# Altium schematic sheet MCU.SchDoc
size A4; SheetNumber: 4; SheetTotal: 5
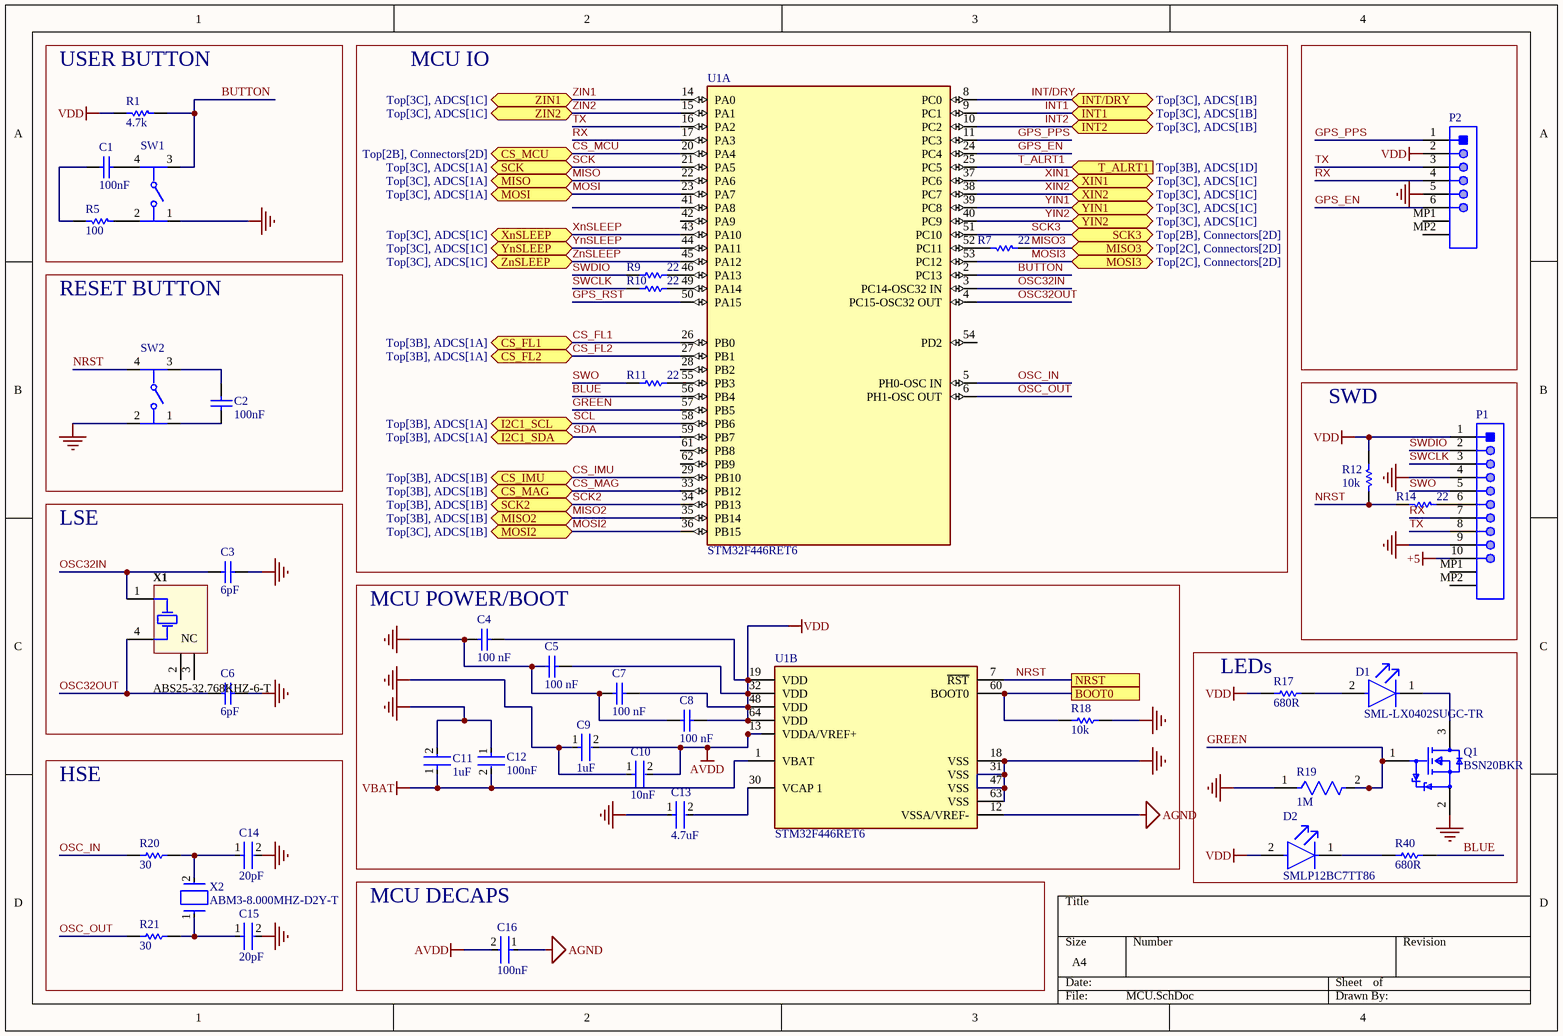
[diagram p0: MCU.SchDoc]

## Parts
C1  100nF  [CAPC1050X55X23ML05T13]
C2  100nF  [CAPC1050X55X23ML05T13]
C3  6pF  [CAPC1005X55X25ML05T10]
C4  100 nF  [CAPC1050X55X23ML05T13]
C5  100 nF  [CAPC1050X55X23ML05T13]
C6  6pF  [CAPC1005X55X25ML05T10]
C7  100 nF  [CAPC1050X55X23ML05T13]
C8  100 nF  [CAPC1050X55X23ML05T13]
C9  1uF  [FP-CL10-IPC_A]
C10  10nF  [FP-CL165-IPC_C]
C11  1uF  [FP-CL10-IPC_C]
C12  100nF  [FP-CC0402-MFG]
C13  4.7uF  [FP-CC0805-0_85-MFG]
C14  20pF  [FP-CC0603-0_9-MFG]
C15  20pF  [FP-CC0603-0_9-MFG]
C16  100nF  [FP-CC0402-MFG]
D1  SML-LX0402SUGC-TR  [FP-SML-LX0402SUGC-TR-MFG]
D2  SMLP12BC7TT86  [FP-SML-P12-MFG]
P1  SM10B-SHLS-TF(LF)(SN)  [JST-SM10B-SHLS-TF_V]  (value not drawn)
P2  SM06B-SRSS-TB(LF)(SN)  [JST-SM06B-SRSS-TB_V]  (value not drawn)
Q1  BSN20BKR  [FP-SOT23-IPC_C]
R1  4.7k  [RESC1005X40X25LL05T05]
R5  100  [RESC1608X55X30LL15T15]
R7  22  [RESC1608X55X25NL10T15]
R9  22  [RESC1005X40X25ML05T05]
R10  22  [RESC1005X40X25ML05T05]
R11  22  [RESC1005X40X25ML05T05]
R12  10k  [RESC1005X40X25LL05T10]
R14  22  [RESC1608X55X25NL10T15]
R17  680R  [RESC1005X40X25ML05T05]
R18  10k  [RESC1005X40X25LL05T05]
R19  1M  [FP-MCR01-IPC_B]
R20  30  [RESC1609X50X30NL10T20]
R21  30  [RESC1609X50X30NL10T20]
R40  680R  [RESC1005X40X25ML05T05]
SW1  PTS810SJM250SMTRLFS  [FP-PTS810SJM250SMTRLFS-MFG]  (value not drawn)
SW2  PTS810SJM250SMTRLFS  [FP-PTS810SJM250SMTRLFS-MFG]  (value not drawn)
U1  STM32F446RET6  [FP-LQFP64-5W-MFG]  (parts A,B of 2)
X1  ABS25-32.768KHZ-6-T  [ABRA-ABS25-4_V]
X2  ABM3-8.000MHZ-D2Y-T  [FP-ABM3-MFG]

## Blocks framed on the sheet
USER BUTTON: C1 R1 R5 SW1
MCU IO: R7 R9-R11 U1
RESET BUTTON: C2 SW2
SWD: P1 R12 R14
LSE: C3 C6 X1
MCU POWER/BOOT: C4 C5 C7-C13 R18 U1
LEDs: D1 D2 Q1 R17 R19 R40
HSE: C14 C15 R20 R21 X2
MCU DECAPS: C16

## Ports
BOOT0 (see Top[2B], Connectors[2D]), CS_FL1 (bidir, see Top[3B], ADCS[1A]), CS_FL2 (bidir, see Top[3B], ADCS[1A]), CS_IMU (bidir, see Top[3B], ADCS[1B]), CS_MAG (bidir, see Top[3B], ADCS[1B]), CS_MCU (bidir, see Top[2B], Connectors[2D]), I2C1_SCL (bidir, see Top[3B], ADCS[1A]), I2C1_SDA (bidir, see Top[3B], ADCS[1A]), INT1 (bidir, see Top[3C], ADCS[1B]), INT2 (bidir, see Top[3C], ADCS[1B]), INT/DRY (bidir, see Top[3C], ADCS[1B]), MISO2 (bidir, see Top[3B], ADCS[1B]), MISO3 (bidir, see Top[2C], Connectors[2D]), MISO (bidir, see Top[3C], ADCS[1A]), MOSI2 (bidir, see Top[3C], ADCS[1B]), MOSI3 (bidir, see Top[2C], Connectors[2D]), MOSI (bidir, see Top[3C], ADCS[1A]), NRST (see Top[2B], Connectors[2D]), SCK2 (bidir, see Top[3B], ADCS[1B]), SCK3 (bidir, see Top[2B], Connectors[2D]), SCK (bidir, see Top[3C], ADCS[1A]), T_ALRT1 (in, see Top[3B], ADCS[1D]), XIN1 (bidir, see Top[3C], ADCS[1C]), XIN2 (bidir, see Top[3C], ADCS[1C]), XnSLEEP (bidir, see Top[3C], ADCS[1C]), YIN1 (bidir, see Top[3C], ADCS[1C]), YIN2 (bidir, see Top[3C], ADCS[1C]), YnSLEEP (bidir, see Top[3C], ADCS[1C]), ZIN1 (bidir, see Top[3C], ADCS[1C]), ZIN2 (bidir, see Top[3C], ADCS[1C]), ZnSLEEP (bidir, see Top[3C], ADCS[1C])

## Nets
+5: P1.10
AGND: C16.1 U1.12(VSSA/VREF-)
AVDD: C9.2 C10.2 C16.2 U1.13(VDDA/VREF+)
GND: C3.2 C4.1 C5.1 C6.2 C7.1 C8.1 C9.1 C10.1 C11.2 C12.1 C13.1 C14.2 C15.2 P1.4 P1.9 P2.5 Q1.2(S) R18.1 R19.1 SW1.1 SW2.2 U1.18(VSS) U1.31(VSS) U1.47(VSS) U1.63(VSS)
VBAT: C11.1 C12.2 U1.1(VBAT)
VDD: C4.2 C5.2 C7.2 C8.2 D2.2(A) P1.1 P2.2 R1.2 R12.1 R17.1 U1.19(VDD) U1.32(VDD) U1.48(VDD) U1.64(VDD)
BLUE: R40.2 U1.56(PB4)
BOOT0: R18.2 U1.60(BOOT0) ; port BOOT0
BUTTON: R1.1 SW1.3 U1.2(PC13)
CS_FL1: U1.26(PB0) ; port CS_FL1
CS_FL2: U1.27(PB1) ; port CS_FL2
CS_IMU: U1.29(PB10) ; port CS_IMU
CS_MAG: U1.33(PB12) ; port CS_MAG
CS_MCU: U1.20(PA4) ; port CS_MCU
GPS_EN: P2.6 U1.24(PC4)
GPS_PPS: P2.1 U1.11(PC3)
GPS_RST: U1.50(PA15)
GREEN: Q1.1(G) R19.2 U1.57(PB5)
INT1: U1.9(PC1) ; port INT1
INT2: U1.10(PC2) ; port INT2
INT/DRY: U1.8(PC0) ; port INT/DRY
MISO: U1.22(PA6) ; port MISO
MISO2: U1.35(PB14) ; port MISO2
MISO3: R7.1 ; port MISO3
MOSI: U1.23(PA7) ; port MOSI
MOSI2: U1.36(PB15) ; port MOSI2
MOSI3: U1.53(PC12) ; port MOSI3
NRST: R12.2 R14.2 SW2.4 U1.7(~{RST}) ; port NRST
OSC32IN: C3.1 U1.3(PC14-OSC32_IN) X1.1(X1)
OSC32OUT: C6.1 U1.4(PC15-OSC32_OUT) X1.4(X2)
OSC_IN: R20.1 U1.5(PH0-OSC_IN)
OSC_OUT: R21.1 U1.6(PH1-OSC_OUT)
RX: P1.7 P2.4 U1.17(PA3)
SCK: U1.21(PA5) ; port SCK
SCK2: U1.34(PB13) ; port SCK2
SCK3: U1.51(PC10) ; port SCK3
SCL: U1.58(PB6) ; port I2C1_SCL
SDA: U1.59(PB7) ; port I2C1_SDA
SWCLK: P1.3 R10.1
SWDIO: P1.2 R9.1
SWO: P1.5 R11.1
T_ALRT1: U1.25(PC5) ; port T_ALRT1
TX: P1.8 P2.3 U1.16(PA2)
XIN1: U1.37(PC6) ; port XIN1
XIN2: U1.38(PC7) ; port XIN2
XnSLEEP: U1.43(PA10) ; port XnSLEEP
YIN1: U1.39(PC8) ; port YIN1
YIN2: U1.40(PC9) ; port YIN2
YnSLEEP: U1.44(PA11) ; port YnSLEEP
ZIN1: U1.14(PA0) ; port ZIN1
ZIN2: U1.15(PA1) ; port ZIN2
ZnSLEEP: U1.45(PA12) ; port ZnSLEEP
NetC1_1: C1.1 SW1.4
NetC1_2: C1.2 R5.2
NetC2_1: C2.1 SW2.1
NetC2_2: C2.2 SW2.3
NetC13_2: C13.2 U1.30(VCAP_1)
NetC14_1: C14.1 R20.2 X2.2
NetC15_1: C15.1 R21.2 X2.1
NetD1_1: D1.1(C) Q1.3(D)
NetD1_2: D1.2(A) R17.2
NetD2_1: D2.1(C) R40.1
NetP1_6: P1.6 R14.1
NetR5_1: R5.1 SW1.2
NetR7_2: R7.2 U1.52(PC11)
NetR9_2: R9.2 U1.46(PA13)
NetR10_2: R10.2 U1.49(PA14)
NetR11_2: R11.2 U1.55(PB3)

Not connected (* = marked no-connect by the designer): P1 MP1 MP2; P2 MP1 MP2; U1 28(PB2) 41(PA8) 42(PA9) 54(PD2) 61(PB8) 62(PB9); X1 2(NC) 3(NC)

## Library data of the parts
C1 C2 C4 C5 C7 C8 = CMP-2000-05439-1: Chip Capacitor, 100 nF, +/- 10%, 16 V, -55 to 125 degC, 0402 (1005 Metric), RoHS, Tape and Reel; Manufacturer: Samsung Electro-Mechanics; Capacitance: 100000pF; Dielectric: X7R; Rated Voltage: 16V; Case Size/Dimension: 0402; Tolerance (%): ±10%; Manufacturer URL: http://www.samsungsem.com/global/index.jsp; Datasheet URL: https://datasheet.ciiva.com/29198/458718-da-01-en-vs-kondensator-0402-29198423.pdf; Datasheet Version: Nov-10
C3 C6 = CMP-2008-04413-1: Part Number: GRM1555C1H6R0DA01D; Manufacturer: Murata
C9 = CMP-13271-001457-1: Cap Ceramic 1uF 16V X5R ±10% Pad SMD 0603 +85°C T/R; Dielectric: X5R; Height: 0.8mm; Capacitance: 1uF; Mount: Surface Mount; Thickness: 0.035inch; Width: 0.031inch; Min Operating Temperature: -55°C; Contact Plating: Tin; Case Code (Imperial): 0603; Depth: 0.8mm; Length: 1.6mm; Max Operating Temperature: 85°C; Packaging: Tape and Reel; Tolerance: 10%; Radiation Hardening: No; Case/Package: 0603; Package Quantity: 1; Voltage Rating: 16V; Case Code (Metric): 1608; Voltage: 16V; Material: Ceramic; Lead Free: Lead Free; Voltage Rating (DC): 16V
C10 = CMP-13271-000387-1: Cap Ceramic 10nF 50V X7R ±10% SMD 0402 +125°C Paper T/R; Depth: 0.5mm; Length: 1mm; Lead Free: Lead Free; Case Code (Metric): 1005; Width: 0.02inch; Min Operating Temperature: -55°C; Thickness: 0.022inch; Package Quantity: 1; Mount: Surface Mount; Height: 0.5mm; Voltage: 50V; Material: Ceramic; Tolerance: 10%; Case Code (Imperial): 0402; Radiation Hardening: No; Case/Package: 0402; Max Operating Temperature: 125°C; Voltage Rating (DC): 50V; Contact Plating: Tin; Packaging: Tape and Reel; Voltage Rating: 50V; Capacitance: 10nF; Dielectric: X7R
C11 = CMP-13271-004127-1: Cap Ceramic 1uF 25V X5R ±10% Pad SMD 0603 +85°C T/R; Height: 0.8mm; Capacitance: 1uF; Depth: 0.8mm; Package Quantity: 1; Mount: Surface Mount; Contact Plating: Tin; Voltage Rating: 25V; Dielectric: X5R; Packaging: Tape and Reel; Material: Ceramic; Case Code (Metric): 1608; Length: 1.6mm; Voltage: 25V; Min Operating Temperature: -55°C; Width: 0.031inch; Tolerance: 10%; Case/Package: 0603; Radiation Hardening: No; Case Code (Imperial): 0603; Thickness: 0.035inch; Lead Free: Lead Free; Max Operating Temperature: 85°C; Voltage Rating (DC): 25V
C12 C16 = CMP-03422-000048-1: CAP CER 0.1UF 16V X7R 0402; Manufacturer: YAGEO; Manufacturer Part Number: CC0402KRX7R7BB104; Material: Ceramic; Automotive Grade: NA; Temperature Coefficient: 30ppm/°C; Tolerance: 0.1; Device Class L1: Passive Components; Temperature Range Low: -55°C; Device Class L3: Ceramic Capacitors; Temperature Characteristic: X7R; Ipc Land Pattern Name: CAPC10050X50; Capacitance: 100 nF; Temperature Range High: +125°C; Voltage Rating: 16 V; Temperature: -55°C to +125°C; RoHS: TRUE; Automotive: No; Height: 0.55mm; Device Class L2: Capacitors; Digikey Description: CAP CER 0.1UF 16V X7R 0402; Package: CC0402; Footprint Url: http://www.yageo.com/exep/pages/download/literatures/UPY-C_GEN_24.pdf; ComponentLink2Description: Datasheet; Category: Cap; Lead Free: Yes; Value: 100 nF; Octopart: https://octopart.com/cc0402krx7r7bb104-yageo-42244624; ComponentLink2URL: http://www.yageo.com/documents/recent/UPY-GP_NP0_16V-to-50V_16.pdf; Mouser Description: 0402 0.1 uF 16 V ±10 % Tolerance X7R SMT Multilayer Ceramic Capacitor
C13 = CMP-03422-000207-1: CAP CER 4.7UF 16V X7R 0805; Manufacturer: Yageo; Manufacturer Part Number: CC0805KKX7R7BB475; Tolerance: 0.1; Material: Ceramic; Footprint Url: http://www.yageo.com/exep/pages/download/literatures/UPY-C_GEN_24.pdf; Device Class L3: Ceramic Capacitors; Temperature: -30°C to +85°C; Device Class L2: Capacitors; Automotive: No; Digikey Description: CAP CER 4.7UF 16V X7R 0805; Temperature Range High: +85°C; Lead Free: Yes; Mouser Description: Multilayer Ceramic Capacitors MLCC - SMD/SMT 4.7M pF 10% 16 Volts; Temperature Characteristic: X7R; Height: 0.95mm; Device Class L1: Passive Components; ComponentLink2Description: Datasheet; Category: Cap; Octopart: https://octopart.com/cc0805kkx7r7bb475-yageo-34429188; Temperature Range Low: -30°C; Package: CC0805-0.85; Ipc Land Pattern Name: CAPC200125X85; RoHS: TRUE; Value: 4.7 uF; Capacitance: 4.7 uF; ComponentLink2URL: http://www.yageo.com/documents/recent/UPY-GPHC_Y5V_6.3V-to-50V_8.pdf; Voltage Rating: 16 V
C14 C15 = CMP-03422-001514-1: CAP CER 20PF 50V C0G/NPO 0603; Dielectric: NP0; Tolerance: 5%; Package Quantity: 1; Number of Pins: 2; RoHS Compliant: Yes; Voltage Rating (DC): 50V; Depth: 0.8mm; Resistor Type: Ceramic; Case Code (Imperial): 0603; Max Operating Temperature: 125°C; Width: 0.031inch; Min Operating Temperature: -55°C; Case Code (Metric): 1608; Length: 0.063inch; Voltage Rating: 50V; Lead Free: Lead Free; Packaging: Tape and Reel; Series: CC; Mount: Surface Mount; Termination: SMD/SMT; Case/Package: 0603; Thickness: 0.035inch; Weight: 7.1E-05oz; Capacitance: 20pF
D1 = CMP-57192-000001-1: LED GREEN CLEAR SMD; Forward Voltage: 2.2V; Test Current: 20mA; Luminous Intensity: 45mcd; Lens Style: Diffused; Number of LEDs: 1; Approvals: UL; Lens Color: Colorless; Dominant Wavelength: 574nm; Viewing Angle: 120°; Lead Free: Lead Free; Case/Package: 0402; Number of Pins: 2; Width: 0.5mm; Min Operating Temperature: -40°C; Case Code (Imperial): 0402; Packaging: Tape and Reel; Color: Green; Max Operating Temperature: 85°C; Case Code (Metric): 1005; Mount: Surface Mount; Length: 1mm; Wavelength: 574nm; Height: 0.5mm; Illumination Color: Green; Lens Transparency: Clear; Package Quantity: 1; Forward Current: 20mA
D2 = CMP-08952-000025-1: LED BLUE CLEAR 1006 SMD; Manufacturer: Rohm; Led Orientation: Top View; Reverse Voltage: 5V; Wavelength: 470nm; Luminous Intensity: 17mcd; Power Dissipation: 66mW; Forward Voltage: 2.9V; Forward Current: 5mA; ComponentLink2URL: https://media.digikey.com/pdf/Data%20Sheets/Rohm%20PDFs/SML-P1_Series_RevB.pdf; ComponentLink2Description: Datasheet; Colour: Blue; RoHS: TRUE; Package: SML-P12; Device Class L1: Optoelectronics; Manufacturer Part Number: SMLP12BC7TT86; Automotive: No; Temperature Range Low: -40°C; Temperature: -40°C to +85°C; Height: 0.25mm; Octopart: https://octopart.com/smlp12bc7tt86-rohm-9290887; Digikey Description: LED BLUE CLEAR 1006 SMD; Lead Free: Yes; Device Class L2: LEDs; Category: Diode; Device Class L3: unset; Mouser Description: ROHM SMLP12BC7TT86, SML-P12 PICOLED Series Blue LED, 1006(0402), Rectangle Lens; Temperature Range High: +85°C
P1 = CMP-2000-07083-1: Male Header, Pitch 1 mm, 1 x 10 Position, Height 1.8 mm, -25 to 85 degC; Manufacturer: JST; Datasheet URL: http://www.jst-mfg.com/product/pdf/eng/eSHL.pdf; Mounting Technology: SurfaceMount; Package Reference: SM10B-SHLS-TF; Manufacturer URL: http://www.jst.com/home2.html; Package Description: Male Header, Pitch 1 mm, 1 x 10 Position, Height 1.8 mm; Datasheet Version: 04/2015
P2 = CMP-2000-07080-1: Male Header, Pitch 1 mm, 1 x 6 Position, Height 2.95 mm, -25 to 85 degC, RoHS, Tape and Reel; Manufacturer: JST; No of Positions: 6; Pitch: 1mm; Style/Orientation: RightAngleHeader/Plug; Datasheet URL: https://datasheet.ciiva.com/26894/getdatasheetpartid-708885-26894671.pdf; Package Description: Male Header, Pitch 1 mm, 1 X 6 Position, Height 2.9 mm; Termination: Solder; Manufacturer URL: http://www.jst.com/home2.html; Type: ShroudedHeader; Package Reference: SM06B-SRSS-TB; Datasheet Version: 11/2010; Mounting Technology: SurfaceMount
Q1 = CMP-14409-000038-1: MOSFET N-CH 60V 265MA TO236AB
R1 = CMP-2002-01154-4: Chip Resistor, 4.7 KOhm, +/- 1%, 0.1 W, -55 to 155 degC, 0402 (1005 Metric), RoHS, Tape and Reel; PartNumber: ERJ-2RKF4701X; Voltage Rating: 50 V; Case\/Package: 0402; Power Rating: 100 mW; Height: 0.35 mm; Mounting Technology: Surface Mount; REACH SVHC: Yes; Resistance: 4.7 KOhm; Max Operating Temperature: 155 degC; ComponentLink1Description: Manufacturer URL; ComponentLink2Description: Datasheet; Pins: 2; PackageReference: 0402; Tolerance: 1%; Case Code (Imperial): 0402; Length: 1 mm; PackageDescription: 2-Pin Surface Mount Device, Body 1 x 0.5 mm; RoHSCompliant: true; Package Quantity: 1; Radiation Hardening: No; DatasheetVersion: 04/2015; Width: 0.5 mm; Case Code (Metric): 1005; Mount: Surface Mount; ComponentLink1URL: http://www.panasonic.com/; Min Operating Temperature: -55 degC; Packaging: Cut Tape; ComponentLink2URL: http://industrial.panasonic.com/cdbs/www-data/pdf/RDA0000/AOA0000C86.pdf
R5 = CMP-2000-00179-1: Manufacturer: Panasonic; Part Number: ERJ-3EKF1000V
R7 R14 = CMP-1659-00033-1: Chip Resistor, 22 Ohm, +/- 1%, 0.1 W, -55 to 155 degC, 0603 (1608 Metric), RoHS, Tape and Reel; Max Ouput Current: 8 A; Case\Package: SIP; Max Input Voltage: 1.4 V; ComponentLink2URL: http://www.yageo.com/documents/recent/PYu-RC_Group_51_RoHS_L_04.pdf; RoHSCompliant: true; Max Operating Temperature: 100 degC; PackageDescription: 2-Pin Surface Mount Device, Body 1.6 x 0.8 mm; ComponentLink1Description: Manufacturer URL; ComponentLink1URL: http://www.yageo.com/; Length: 18.5 mm; REACH SVHC: Unknown; Pins: 4; DatasheetVersion: Rev. 4, 02/2016; PackageReference: 0603; Output Current: 8 A; Min Operating Temperature: -25 degC; Height: 19.6 mm; Mount: Through Hole; Radiation Hardening: No; ComponentLink2Description: Datasheet; Package Quantity: 200; Packaging: Rail/Tube
R9-R11 = CMP-2002-01135-4: Chip Resistor, 22 Ohm, +/- 1%, 0.1 W, -55 to 155 degC, 0402 (1005 Metric), RoHS, Tape and Reel; PartNumber: ERJ-2RKF22R0X; Case\/Package: 0402; Resistance: 22 Ohm; Power Rating: 100 mW; Voltage Rating: 50 V; ComponentLink2Description: Datasheet; Packaging: Tape and Reel; Weight: 2.8E-05oz; Pins: 2; Case Code (Imperial): 0402; Width: 0.5 mm; ComponentLink2URL: http://industrial.panasonic.com/cdbs/www-data/pdf/RDA0000/AOA0000C86.pdf; Height: 0.35 mm; PackageReference: 0402; REACH SVHC: Yes; Min Operating Temperature: -55 degC; Length: 1 mm; DatasheetVersion: 04/2015; RoHSCompliant: true; Package Quantity: 10000; Case Code (Metric): 1005; PackageDescription: 2-Pin Surface Mount Device, Body 1 x 0.5 mm; ComponentLink1URL: http://www.panasonic.com/; Mount: Surface Mount; Mounting Technology: Surface Mount; Tolerance: 1%; Max Operating Temperature: 155 degC; ComponentLink1Description: Manufacturer URL
R12 = CMP-2002-07353-1: Part Number: RC0402FR-0710KL; Manufacturer: Yageo / Phycomp
R17 R40 = CMP-2002-00166-1: Manufacturer: Vishay Dale; Part Number: CRCW0402680RFKED
R18 = CMP-2000-07588-1: Chip Resistor, 10 KOhm, +/- 1%, 0.1 W, -55 to 155 degC, 0402 (1005 Metric), RoHS, Tape and Reel; Manufacturer: Panasonic; Power Rating: 100mW; Voltage Rating: 50V; Resistance: 10KOhm; Case\/Package: 0402; Temperature Coefficient: 100ppm\/degreesC; RoHSCompliant: True; Lead Free: LeadFree; Package Quantity: 1; Contact Plating: Tin; Length: 1mm; Radiation Hardening: No; REACH SVHC: NoSVHC; Max Operating Temperature: 155degC; Depth: 0.5mm; Case Code (Imperial): 0402; Military Standard: Not; Package Description: 2-Pin Surface Mount Device, Body 1 x 0.5 mm; Termination: SMD/SMT; Case Code (Metric): 1005; Height: 0.35mm; Packaging: TapeandReel; Voltage Rating (DC): 50V; Package Reference: 402; Number of Pins: 2; Tolerance: 1%; Mounting Technology: SurfaceMount; Width: 0.02inch; Mount: SurfaceMount; Datasheet URL: https://industrial.panasonic.com/cdbs/www-data/pdf/RDA0000/AOA0000C304.pdf; Composition: ThickFilm; Datasheet Version: 02/2017; Manufacturer URL: http://www.panasonic.com/; Max Power Dissipation: 100mW; Number of Terminations: 2; Min Operating Temperature: -55degC
R19 = CMP-08839-019445-1: Thick Film Chip Resistor, 0402, 1MΩ, 1%, 100ppm/°C, 0.063W, 50V; Max Power Dissipation: 63mW; Resistance: 1MR; Lead Free: Lead Free; Case Code (Imperial): 0402; Max Operating Temperature: 155°C; Package Quantity: 1; Length: 0.039inch; Temperature Coefficient: 100ppm/°C; Case Code (Metric): 1005; Tolerance: 1%; Case/Package: 0402; RoHS Compliant: Yes; Number of Terminations: 2; Resistor Type: Thick Film; Height: 0.016inch; Packaging: Tape and Reel; Min Operating Temperature: -55°C; Voltage Rating (DC): 50V; Width: 0.02inch; Series: MCR
R20 R21 = CMP-2000-03228-1: Part Number: CRCW060330R0FKEA; Manufacturer: Vishay Dale
SW1 SW2 = CMP-10040-000001-2: SWITCH TACTILE SPST-NO 0.05A 16V; Throw Configuration: SPST; Operating Force: 160gf; Actuator Type: Standard; Switch Travel: 0.15mm; Switch Function: Off-Mom; Max Current Rating: 50mA; Mechanical Life: 150000Cycles; Illumination Type: Non-Illuminated; Package Quantity: 2900; Depth: 4.6mm; Mount: Surface Mount; Packaging: Tape and Reel; Length: 3.2mm; RoHS Compliant: Yes; Case/Package: SMD/SMT; Voltage Rating (DC): 16V; Min Operating Temperature: -40°C; Termination: J-Bend; Lead Free: Lead Free; Contact Plating: Silver; Orientation: Straight; Max Operating Temperature: 85°C; Current Rating: 50mA; Color: Black
U1 = CMP-12105-000007-1: IC MCU 32BIT 512KB FLASH 64LQFP; Manufacturer: ST; Number Of Spi Channels: 4; Ram Size: 128KBytes; Standoff Height: 0.05mm; Number Of Uart Channels: 6; Number Of Pwm Channels: 32; Max Junction Temp: +105°C; Number Of I/Os: 50; Number Of Usb Channels: 2; Frequency: 180MHz; Number Of A/D Converters: 3; Max Supply Voltage: 3.6V; Number Of Adc Channels: 16; Interface: I2C,SPI,UART,USART,CAN,USB,LIN,IrDA,I2S,Other; Memory Size: 512KBytes; Number Of Timers/Counters: 14; Min Supply Voltage: 1.7V; Core Architecture: ARM Cortex-M4; Data Bus Width: 32bits; Number Of Cores: 1; Ambient Temperature Range Low: -40°C; ComponentLink2URL: https://www.st.com/en/microcontrollers-microprocessors/stm32f446re.html; Category: IC; Height: 1.6mm; Ipc Land Pattern Name: QFP50P1200X1200X160-64; Manufacturer Part Number: STM32F446RET6; Octopart: https://octopart.com/stm32f446ret6-stmicroelectronics-52642920; Temperature Range High: +105°C; Lead Free: Yes; Mouser Description: ARM Microcontrollers - MCU High-performance and DSP with FP, ARM Cortex-M4 MCU with 512 Kbytes Flash, 180 MHz CPU, Art Accelerator, SDRAM; Digikey Description: IC MCU 32BIT 512KB FLASH 64LQFP; Ambient Temperature Range High: +85°C; Number Of I2C Channels: 4; Memory Type: FLASH; RoHS: TRUE; Automotive: No; Device Class L1: Integrated Circuits (ICs); Temperature: -40°C to +105°C; Device Class L2: Embedded Processors and Controllers; Device Class L3: Microcontrollers; Temperature Range Low: -40°C; Package: LQFP64-5W; ComponentLink2Description: Datasheet
X1 = CMP-2000-05036-1: Low Frequency Crystal, 32.768 KHz, 6 pF, +/- 20 ppm, -40 to 85 degC, 4-Pin SMD, RoHS, Tape and Reel; Manufacturer: Abracon; Tolerance: 20PPM; ESR: 50kOhms; Case Width: 3.8mm; Case Height: 2.5mm; Case Length: 8mm; Load Capacitance: 6pF; Operating Temperature Range: -40Cto+85C; Package Reference: ABS25; Factory Pack Quantity: 3000; Package Description: 4-Pin Surface Mount Device, Body 8 x 3.8 mm, Pitch 5.5 mm; Frequency: 32.768kHz; Termination Style: SMD/SMT; Manufacturer URL: http://www.abracon.com/; Type: LowFrequencyCrystal; Dimensions: 3.8mmWx8mmLx2.5mmH; Product Category: Crystals; Series: ABS25; RoHS: Details; Package / Case: 8mmx3.8mm; Datasheet Version: Jun-17; Brand: ABRACON; Datasheet URL: https://datasheet.ciiva.com/854/abs25-854528.pdf; Packaging: Reel; Mounting Style: SMD/SMT
X2 = CMP-2000-05033-2: Crystal 8MHz ±20ppm 18pF SMD-2 5mm x 3.2mm; Series Resistance: 500R; Frequency Stability: 30ppm; ESR (Equivalent Series Resistance): 140R; Load Capacitance: 18pF; Height: 0.051inch; Tolerance: 20ppm; Depth: 3.2mm; Max Operating Temperature: 85°C; Frequency: 8MHz; Termination: SMD/SMT; Lead Free: Lead Free; Number of Pins: 2; Width: 3.2mm; RoHS Compliant: Yes; Resistor Type: Ceramic; Length: 5mm; Mount: Surface Mount; Case/Package: CSMD; Package Quantity: 1000; Radiation Hardening: No; Min Operating Temperature: -40°C; Packaging: Tape and Reel; Frequency Tolerance: 20ppm